# Altium schematic sheet NIXIEClock.SchDoc
size A1; SheetNumber: 1; SheetTotal: 1
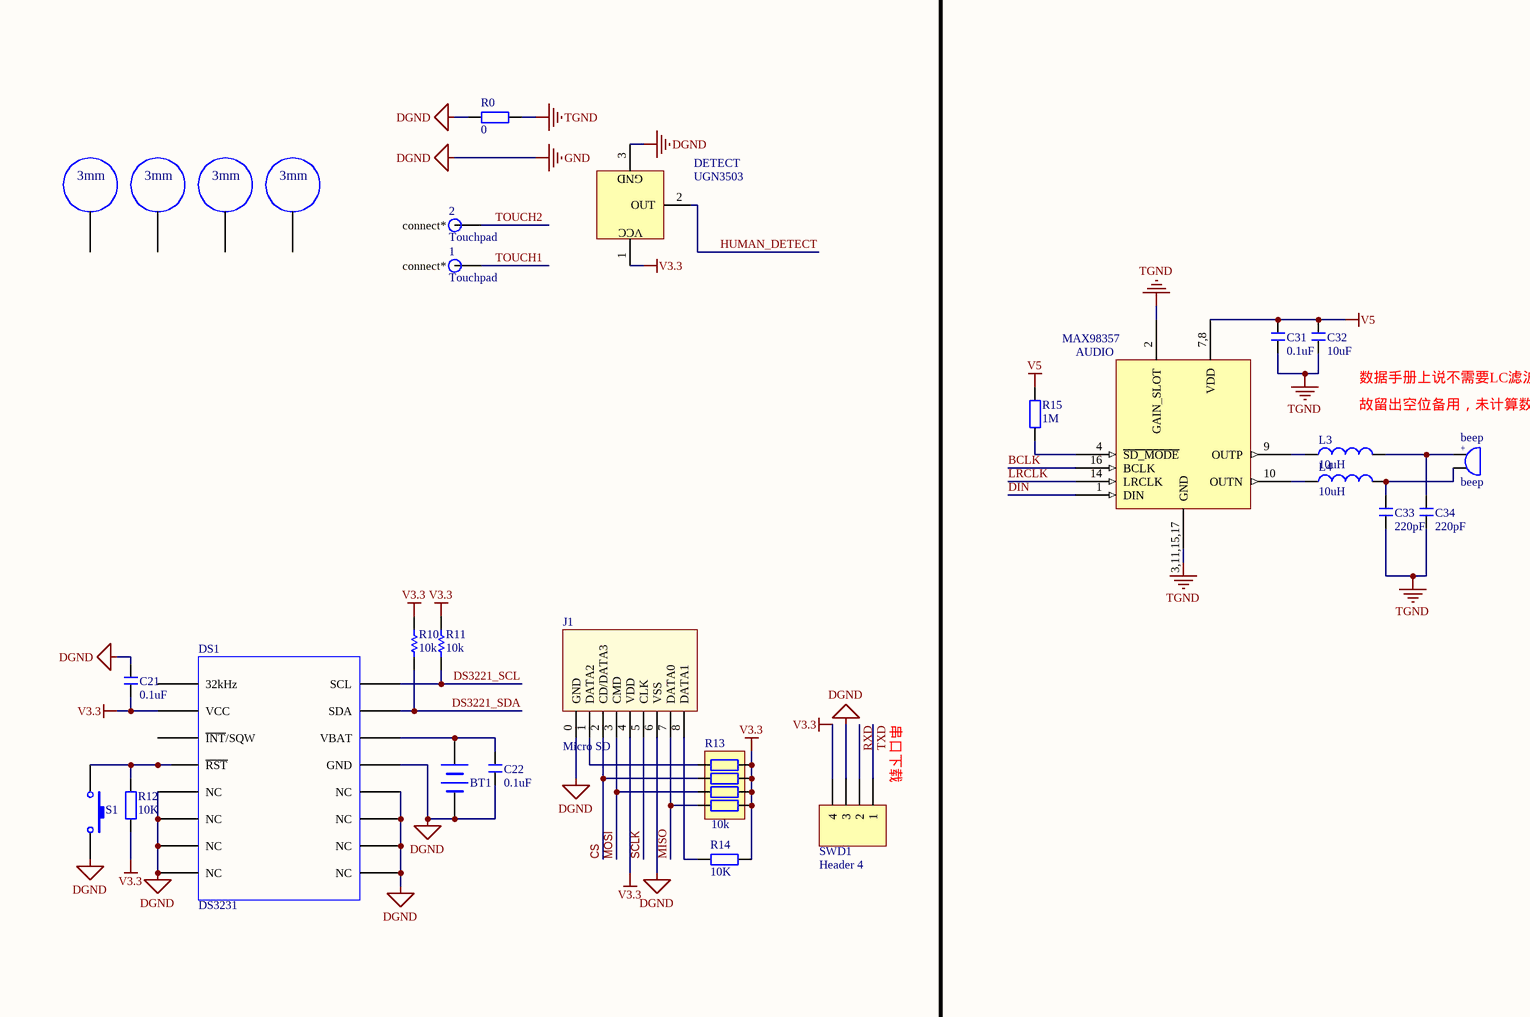
[diagram p0: NIXIEClock.SchDoc, top left]
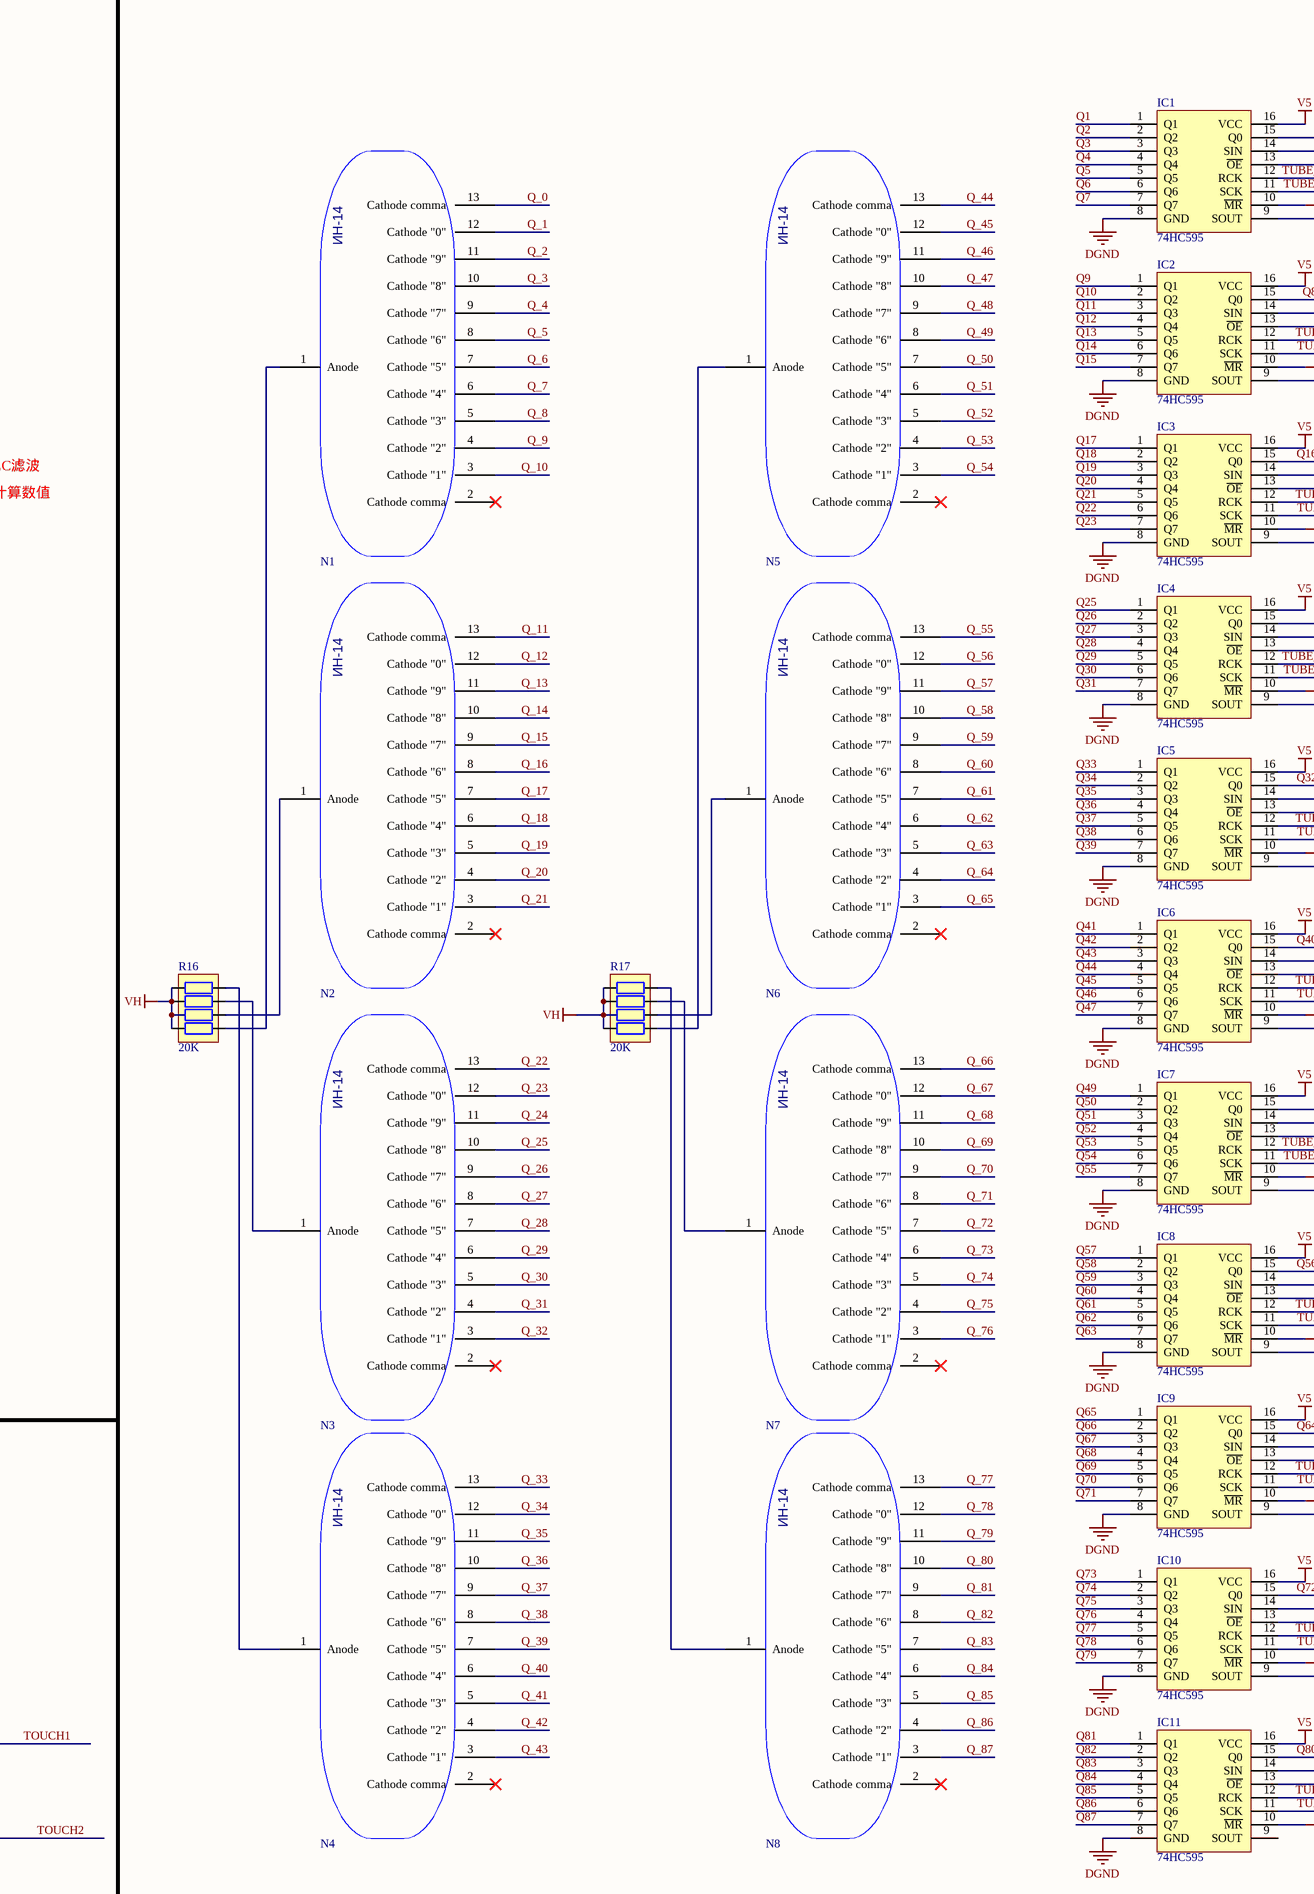
[diagram p1: NIXIEClock.SchDoc, top middle]
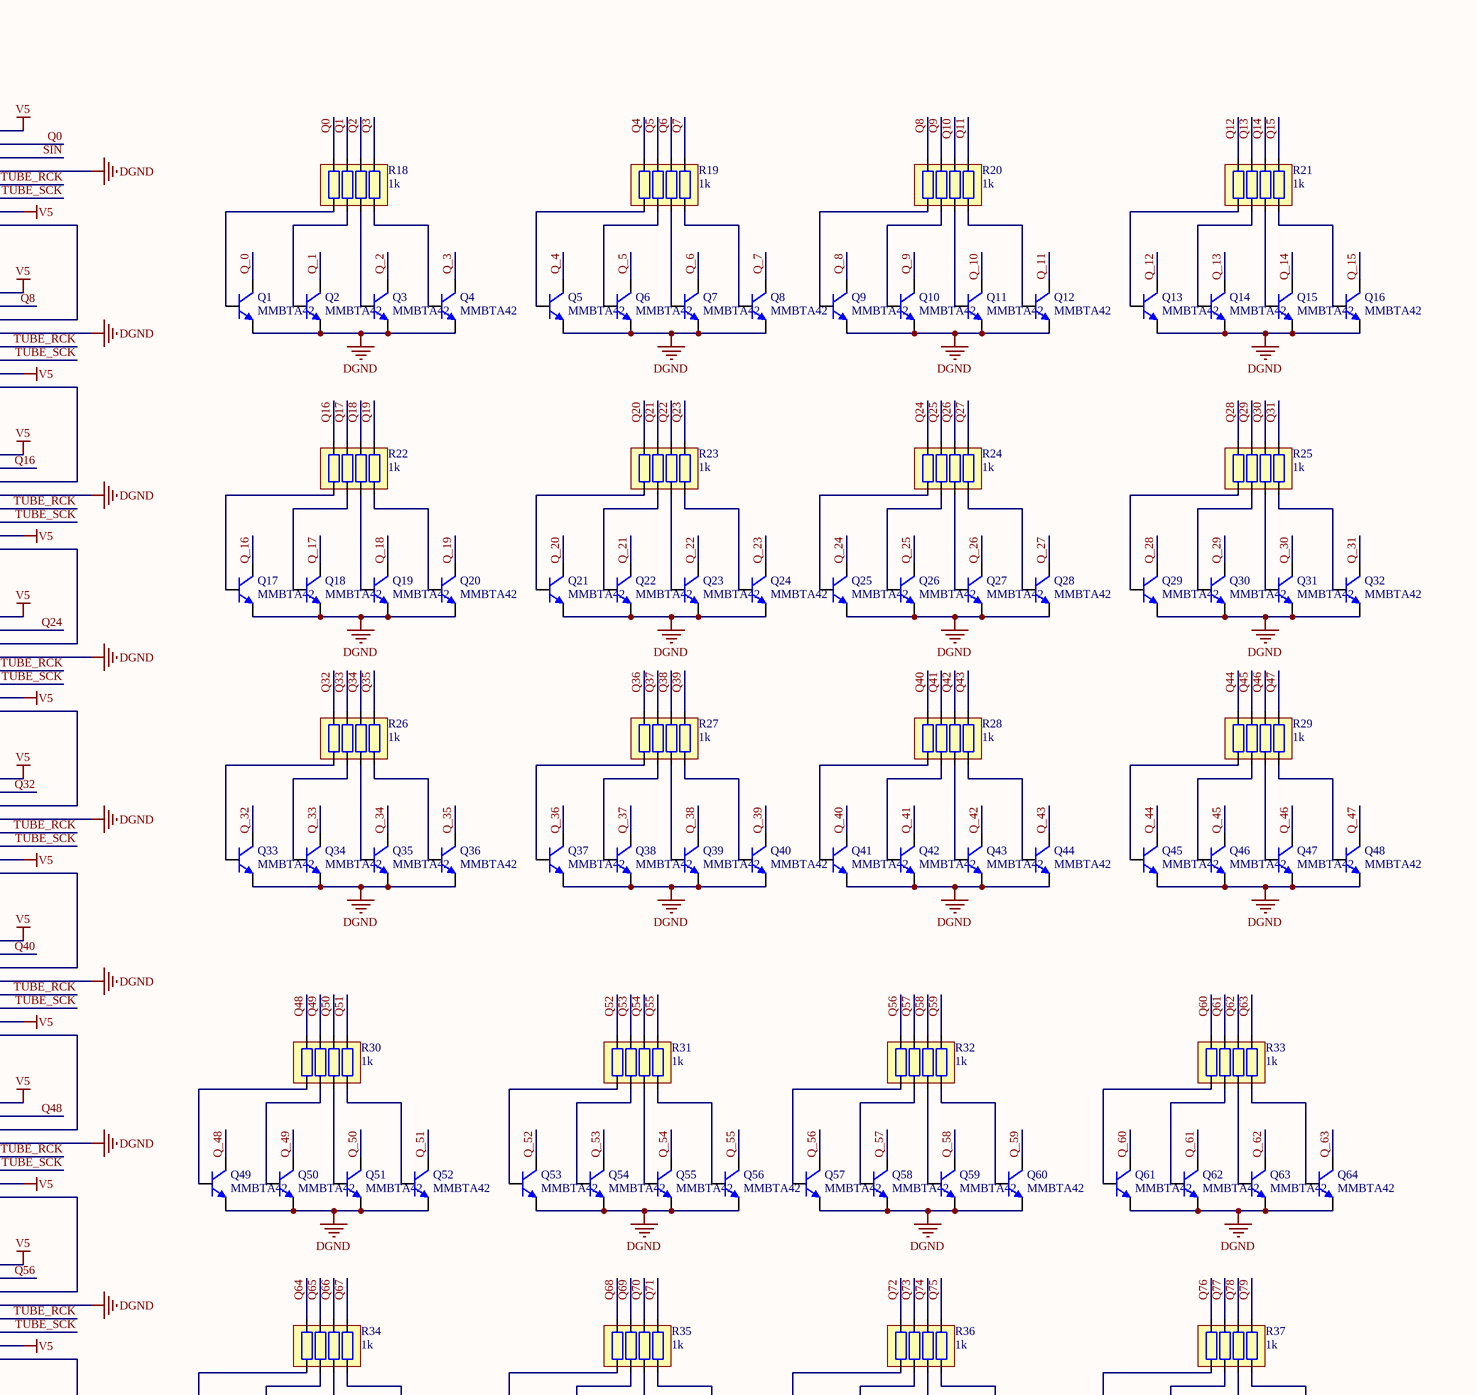
[diagram p2: NIXIEClock.SchDoc, top right]
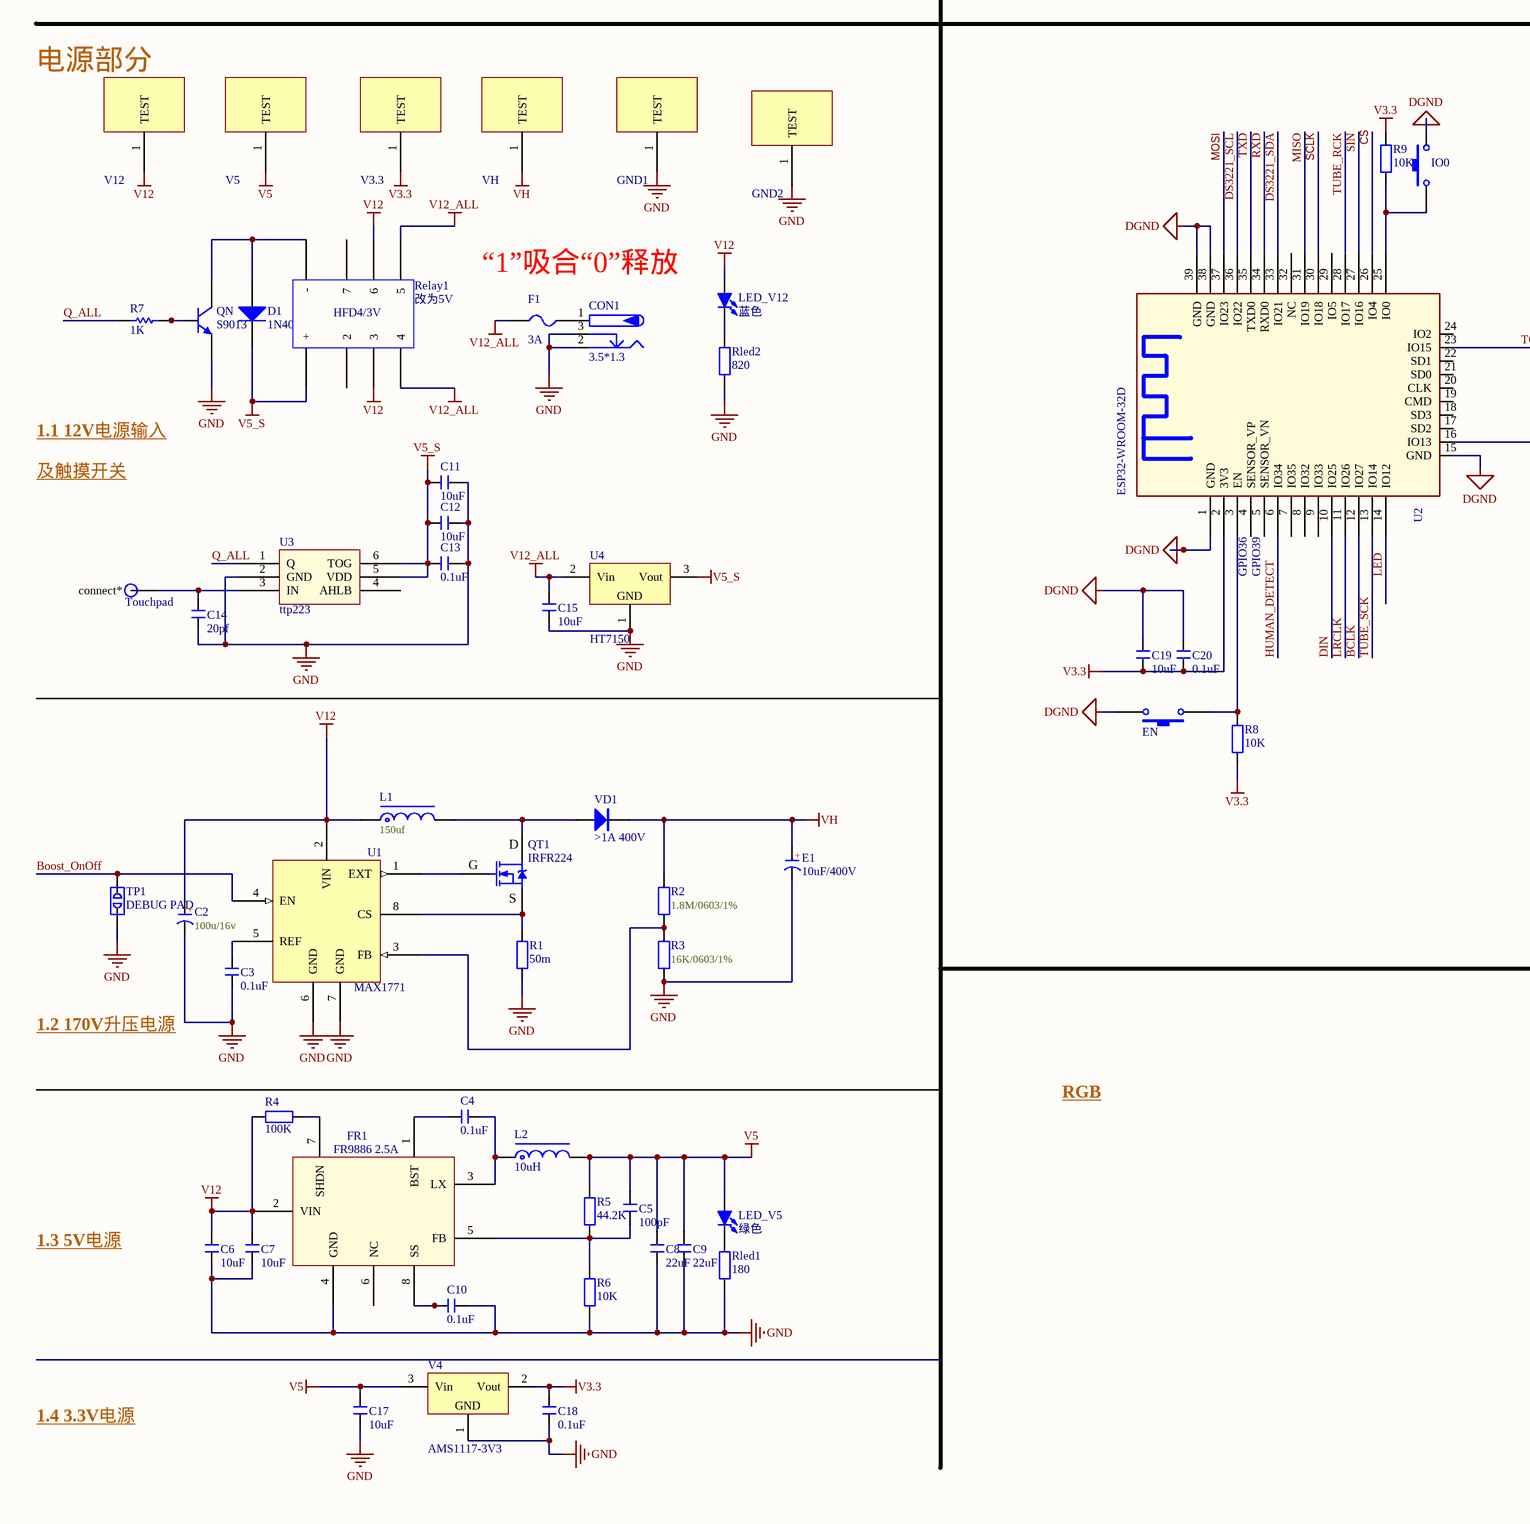
[diagram p3: NIXIEClock.SchDoc, bottom left]
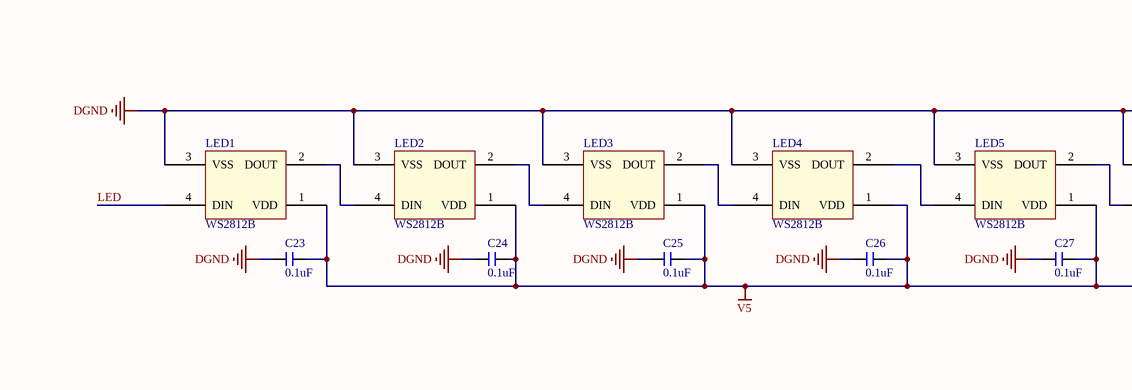
[diagram p4: NIXIEClock.SchDoc, bottom middle]
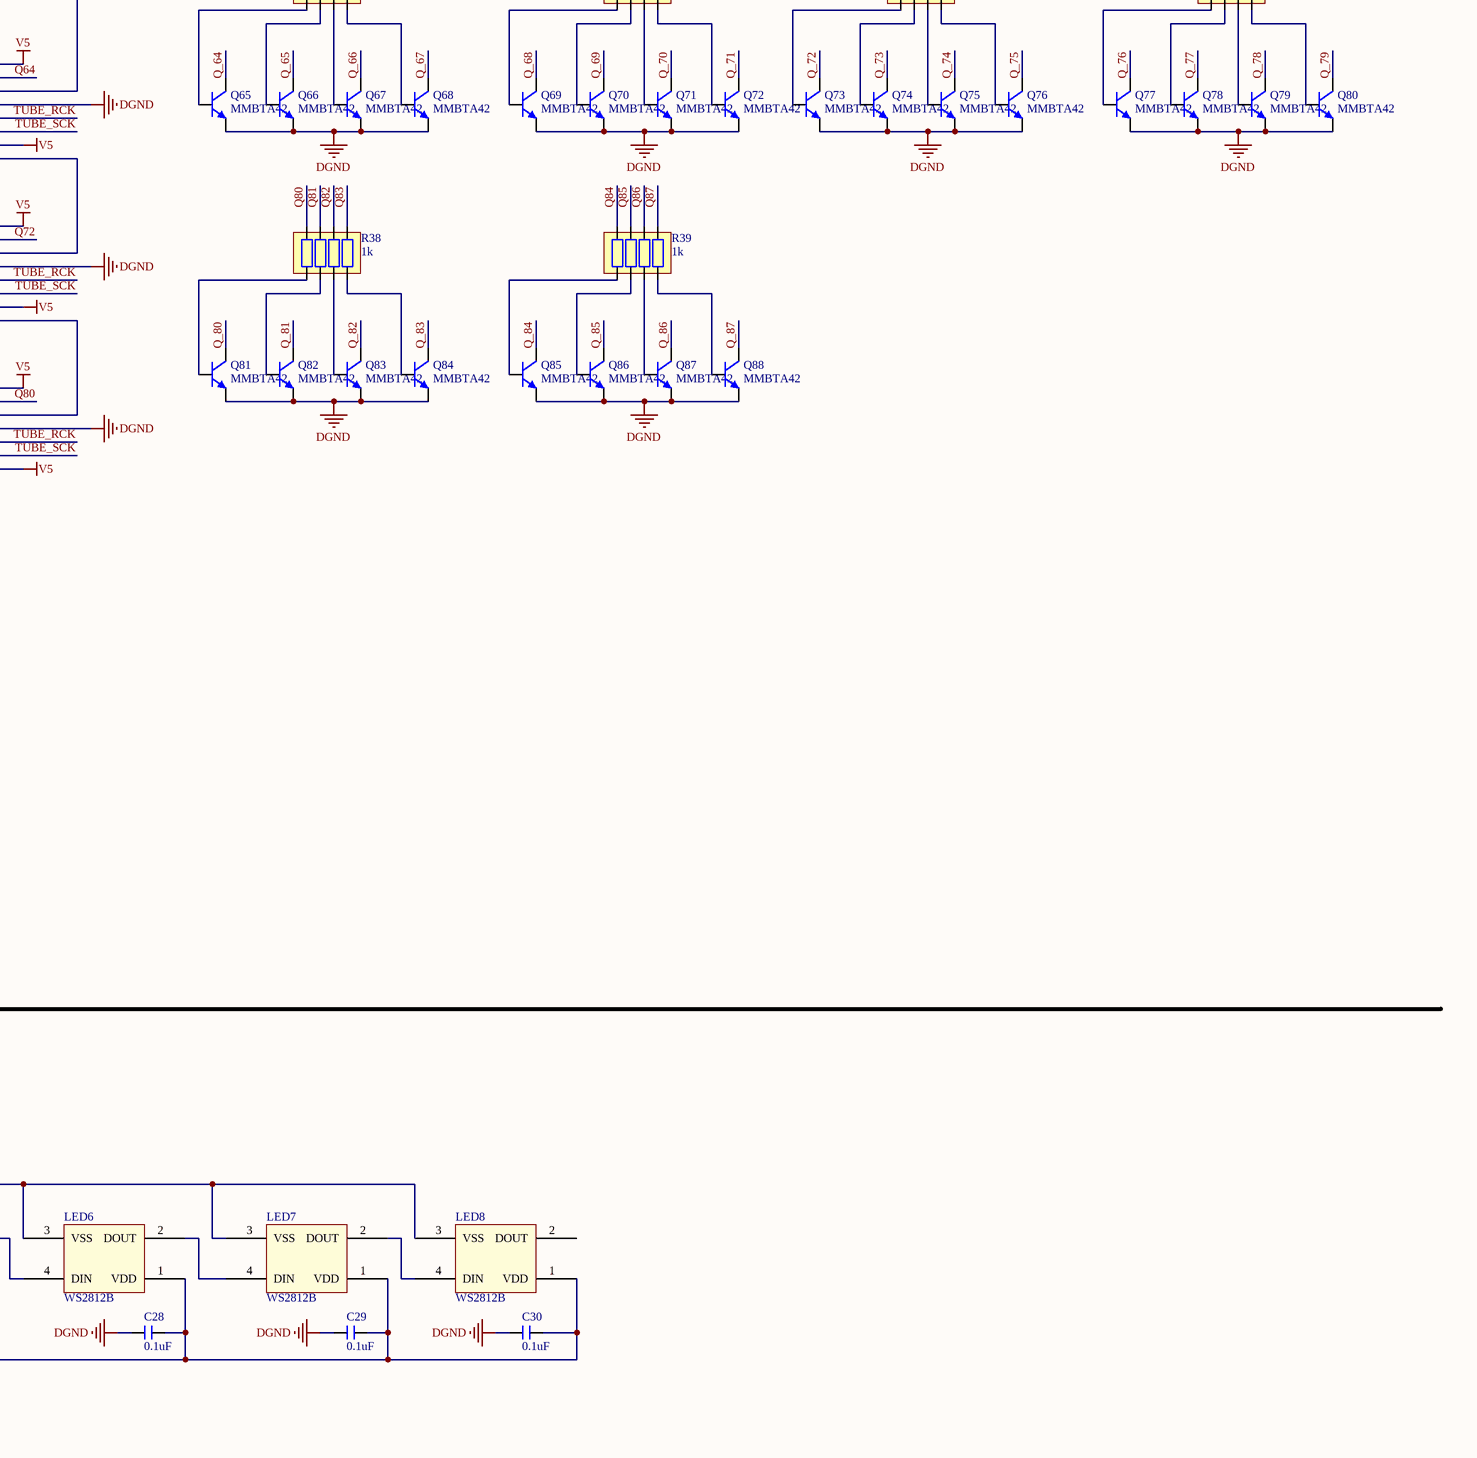
[diagram p5: NIXIEClock.SchDoc, bottom right]

## Parts
1  Touchpad  [TOUCHPAD]
2  Touchpad  [TOUCHPAD]
AUDIO  MAX98357  [QFN16_3X3]
beep  beep  [BEEP2]
BT1  CR1220 holder  [BAT1220]  (value not drawn)
C2  100u/16v  [CD C(6032)]
C3  0.1uF  [C 0603_L]
C4  0.1uF  [C 0603_L]
C5  100pF  [C 0603_L]
C6  10uF  [C 0805_L]
C7  10uF  [C 0805_L]
C8  22uF  [C 0805_L]
C9  22uF  [C 0805_L]
C10  0.1uF  [C 0603_L]
C11  10uF  [C 0805_L]
C12  10uF  [C 0805_L]
C13  0.1uF  [C 0603_L]
C14  20pf  [C 0603]
C15  10uF  [C 0805_L]
C17  10uF  [C 0805_L]
C18  0.1uF  [C 0603_L]
C19  10uF  [C 0805_L]
C20  0.1uF  [C 0603_L]
C21  0.1uF  [C 0603_L]
C22  0.1uF  [C 0603_L]
C23  0.1uF  [C 0603_L]
C24  0.1uF  [C 0603_L]
C25  0.1uF  [C 0603_L]
C26  0.1uF  [C 0603_L]
C27  0.1uF  [C 0603_L]
C28  0.1uF  [C 0603_L]
C29  0.1uF  [C 0603_L]
C30  0.1uF  [C 0603_L]
C31  0.1uF  [C 0603_L]
C32  10uF  [C 0805_L]
C33  220pF  [C 0805_L]
C34  220pF  [C 0805_L]
CON1  3.5*1.3  [DC-050]
D1  1N4007  [1N4007W]
DETECT  UGN3503  [红外热释电]
DS1  DS3231  [SOP16_75MM]
E1  10uF/400V  [CM F(10*10.2)]
EN  SW-PB  [贴片按键（红头）]  (value not drawn)
F1  3A  [FU 1206]
FR1  FR9886 2.5A  [SOP8_N]
GND1  TEST  [TEST]  (value not drawn)
GND2  TEST  [TEST]  (value not drawn)
IC1  74HC595  [TSSOP16_N]
IC2  74HC595  [TSSOP16_N]
IC3  74HC595  [TSSOP16_N]
IC4  74HC595  [TSSOP16_N]
IC5  74HC595  [TSSOP16_N]
IC6  74HC595  [TSSOP16_N]
IC7  74HC595  [TSSOP16_N]
IC8  74HC595  [TSSOP16_N]
IC9  74HC595  [TSSOP16_N]
IC10  74HC595  [TSSOP16_N]
IC11  74HC595  [TSSOP16_N]
IO0  SW-PB  [贴片按键（红头）]  (value not drawn)
J1  Micro SD  [Micro SD]
L1  150uf  [CDRH127]
L2  10uH  [L-SMD-0630]
L3  10uH  [L 0805_L]
L4  10uH  [L 0805_L]
LED1  WS2812B  [WS2812B-5050]
LED2  WS2812B  [WS2812B-5050]
LED3  WS2812B  [WS2812B-5050]
LED4  WS2812B  [WS2812B-5050]
LED5  WS2812B  [WS2812B-5050]
LED6  WS2812B  [WS2812B-5050]
LED7  WS2812B  [WS2812B-5050]
LED8  WS2812B  [WS2812B-5050]
LED_V5  绿色  [LED 0805G]
LED_V12  蓝色  [LED 0805B]
N1  ИН-14  [IN14]  (value not drawn)
N2  ИН-14  [IN14]  (value not drawn)
N3  ИН-14  [IN14]  (value not drawn)
N4  ИН-14  [IN14]  (value not drawn)
N5  ИН-14  [IN14]  (value not drawn)
N6  ИН-14  [IN14]  (value not drawn)
N7  ИН-14  [IN14]  (value not drawn)
N8  ИН-14  [IN14]  (value not drawn)
Q1  MMBTA42  [SOT23-3N]
Q2  MMBTA42  [SOT23-3N]
Q3  MMBTA42  [SOT23-3N]
Q4  MMBTA42  [SOT23-3N]
Q5  MMBTA42  [SOT23-3N]
Q6  MMBTA42  [SOT23-3N]
Q7  MMBTA42  [SOT23-3N]
Q8  MMBTA42  [SOT23-3N]
Q9  MMBTA42  [SOT23-3N]
Q10  MMBTA42  [SOT23-3N]
Q11  MMBTA42  [SOT23-3N]
Q12  MMBTA42  [SOT23-3N]
Q13  MMBTA42  [SOT23-3N]
Q14  MMBTA42  [SOT23-3N]
Q15  MMBTA42  [SOT23-3N]
Q16  MMBTA42  [SOT23-3N]
Q17  MMBTA42  [SOT23-3N]
Q18  MMBTA42  [SOT23-3N]
Q19  MMBTA42  [SOT23-3N]
Q20  MMBTA42  [SOT23-3N]
Q21  MMBTA42  [SOT23-3N]
Q22  MMBTA42  [SOT23-3N]
Q23  MMBTA42  [SOT23-3N]
Q24  MMBTA42  [SOT23-3N]
Q25  MMBTA42  [SOT23-3N]
Q26  MMBTA42  [SOT23-3N]
Q27  MMBTA42  [SOT23-3N]
Q28  MMBTA42  [SOT23-3N]
Q29  MMBTA42  [SOT23-3N]
Q30  MMBTA42  [SOT23-3N]
Q31  MMBTA42  [SOT23-3N]
Q32  MMBTA42  [SOT23-3N]
Q33  MMBTA42  [SOT23-3N]
Q34  MMBTA42  [SOT23-3N]
Q35  MMBTA42  [SOT23-3N]
Q36  MMBTA42  [SOT23-3N]
Q37  MMBTA42  [SOT23-3N]
Q38  MMBTA42  [SOT23-3N]
Q39  MMBTA42  [SOT23-3N]
Q40  MMBTA42  [SOT23-3N]
Q41  MMBTA42  [SOT23-3N]
Q42  MMBTA42  [SOT23-3N]
Q43  MMBTA42  [SOT23-3N]
Q44  MMBTA42  [SOT23-3N]
Q45  MMBTA42  [SOT23-3N]
Q46  MMBTA42  [SOT23-3N]
Q47  MMBTA42  [SOT23-3N]
Q48  MMBTA42  [SOT23-3N]
Q49  MMBTA42  [SOT23-3N]
Q50  MMBTA42  [SOT23-3N]
Q51  MMBTA42  [SOT23-3N]
Q52  MMBTA42  [SOT23-3N]
Q53  MMBTA42  [SOT23-3N]
Q54  MMBTA42  [SOT23-3N]
Q55  MMBTA42  [SOT23-3N]
Q56  MMBTA42  [SOT23-3N]
Q57  MMBTA42  [SOT23-3N]
Q58  MMBTA42  [SOT23-3N]
Q59  MMBTA42  [SOT23-3N]
Q60  MMBTA42  [SOT23-3N]
Q61  MMBTA42  [SOT23-3N]
Q62  MMBTA42  [SOT23-3N]
Q63  MMBTA42  [SOT23-3N]
Q64  MMBTA42  [SOT23-3N]
Q65  MMBTA42  [SOT23-3N]
Q66  MMBTA42  [SOT23-3N]
Q67  MMBTA42  [SOT23-3N]
Q68  MMBTA42  [SOT23-3N]
Q69  MMBTA42  [SOT23-3N]
Q70  MMBTA42  [SOT23-3N]
Q71  MMBTA42  [SOT23-3N]
Q72  MMBTA42  [SOT23-3N]
Q73  MMBTA42  [SOT23-3N]
Q74  MMBTA42  [SOT23-3N]
Q75  MMBTA42  [SOT23-3N]
Q76  MMBTA42  [SOT23-3N]
Q77  MMBTA42  [SOT23-3N]
Q78  MMBTA42  [SOT23-3N]
Q79  MMBTA42  [SOT23-3N]
Q80  MMBTA42  [SOT23-3N]
Q81  MMBTA42  [SOT23-3N]
Q82  MMBTA42  [SOT23-3N]
Q83  MMBTA42  [SOT23-3N]
Q84  MMBTA42  [SOT23-3N]
Q85  MMBTA42  [SOT23-3N]
Q86  MMBTA42  [SOT23-3N]
Q87  MMBTA42  [SOT23-3N]
Q88  MMBTA42  [SOT23-3N]
QN  S9013  [SOT23-3L]
QT1  IRFR224  [TO252]
R0  0  [R 0603]
R1  50m  [R 0805_L]
R2  1.8M/0603/1%  [R 0603]
R3  16K/0603/1%  [R 0603]
R4  100K  [R 0603_L]
R5  44.2K  [R 0603]
R6  10K  [R 0603]
R7  value 1K  [R 0603]  (hidden comment: Res Semi)
R8  10K  [R 0603]
R9  10K  [R 0603]
R10  value 10k  [R 0603]  (hidden comment: Res Semi)
R11  value 10k  [R 0603]  (hidden comment: Res Semi)
R12  10K  [R 0603]
R13  10k  [RCA-8P4R-0603]
R14  10K  [R 0603]
R15  1M  [R 0603]
R16  20K  [RCA-8P4R-0603]
R17  20K  [RCA-8P4R-0603]
R18  1k  [RCA-8P4R-0603]
R19  1k  [RCA-8P4R-0603]
R20  1k  [RCA-8P4R-0603]
R21  1k  [RCA-8P4R-0603]
R22  1k  [RCA-8P4R-0603]
R23  1k  [RCA-8P4R-0603]
R24  1k  [RCA-8P4R-0603]
R25  1k  [RCA-8P4R-0603]
R26  1k  [RCA-8P4R-0603]
R27  1k  [RCA-8P4R-0603]
R28  1k  [RCA-8P4R-0603]
R29  1k  [RCA-8P4R-0603]
R30  1k  [RCA-8P4R-0603]
R31  1k  [RCA-8P4R-0603]
R32  1k  [RCA-8P4R-0603]
R33  1k  [RCA-8P4R-0603]
R34  1k  [RCA-8P4R-0603]
R35  1k  [RCA-8P4R-0603]
R36  1k  [RCA-8P4R-0603]
R37  1k  [RCA-8P4R-0603]
R38  1k  [RCA-8P4R-0603]
R39  1k  [RCA-8P4R-0603]
Relay1  改为5V  [HFD4]
Rled1  180  [R 0603]
Rled2  820  [R 0603]
S1  SW-PB  [贴片按键（红头）]  (value not drawn)
SWD1  Header 4  [HDR2.54-M-WS-4P]
T0  铜柱  [铜柱_六芒星]  (value not drawn)
T1  铜柱  [铜柱_六芒星]  (value not drawn)
T2  铜柱  [铜柱_六芒星]  (value not drawn)
T3  铜柱  [铜柱_六芒星]  (value not drawn)
TOUCH  Touchpad  [TOUCHPAD]
TP1  DEBUG PAD  [DEBUG PAD2]
U1  MAX1771  [SOP8_M]
U2  ESP32-WROOM-32D  [*MODULE_ESP32-WROOM-32D]
U3  ttp223  [SOT23-6L]
U4  HT7150  [SOT89_M]
V3.3  TEST  [TEST]  (value not drawn)
V4  AMS1117-3V3  [SOT223_N]
V5  TEST  [TEST]  (value not drawn)
V12  TEST  [TEST]  (value not drawn)
VD1  >1A 400V  [SMA]
VH  TEST  [TEST]  (value not drawn)

## Nets
DGND: BT1.2(-) C2.2(K) C3.2 C6.1 C7.1 C8.1 C9.1 C10.1 C11.1 C12.1 C13.2 C14.1 C15.2 C17.1 C18.1 C19.2 C20.2 C21.2 C22.2 C23.1 C24.1 C25.1 C26.1 C27.1 C28.1 C29.1 C30.1 CON1.2 CON1.3 DETECT.3(GND) DS1.5(NC) DS1.6(NC) DS1.7(NC) DS1.8(NC) DS1.9(NC) DS1.10(NC) DS1.11(NC) DS1.12(NC) DS1.13(GND) E1.2(K) EN.2 FR1.4(GND) GND1.1(TEST) GND2.1(TEST) IC1.8(GND) IC1.13(~{OE}) IC2.8(GND) IC2.13(~{OE}) IC3.8(GND) IC3.13(~{OE}) IC4.8(GND) IC4.13(~{OE}) IC5.8(GND) IC5.13(~{OE}) IC6.8(GND) IC6.13(~{OE}) IC7.8(GND) IC7.13(~{OE}) IC8.8(GND) IC8.13(~{OE}) IC9.8(GND) IC9.13(~{OE}) IC10.8(GND) IC10.13(~{OE}) IC11.8(GND) IC11.13(~{OE}) IO0.2 J1.0(GND) J1.6(VSS) LED1.3(VSS) LED2.3(VSS) LED3.3(VSS) LED4.3(VSS) LED5.3(VSS) LED6.3(VSS) LED7.3(VSS) LED8.3(VSS) Q1.2(E) Q2.2(E) Q3.2(E) Q4.2(E) Q5.2(E) Q6.2(E) Q7.2(E) Q8.2(E) Q9.2(E) Q10.2(E) Q11.2(E) Q12.2(E) Q13.2(E) Q14.2(E) Q15.2(E) Q16.2(E) Q17.2(E) Q18.2(E) Q19.2(E) Q20.2(E) Q21.2(E) Q22.2(E) Q23.2(E) Q24.2(E) Q25.2(E) Q26.2(E) Q27.2(E) Q28.2(E) Q29.2(E) Q30.2(E) Q31.2(E) Q32.2(E) Q33.2(E) Q34.2(E) Q35.2(E) Q36.2(E) Q37.2(E) Q38.2(E) Q39.2(E) Q40.2(E) Q41.2(E) Q42.2(E) Q43.2(E) Q44.2(E) Q45.2(E) Q46.2(E) Q47.2(E) Q48.2(E) Q49.2(E) Q50.2(E) Q51.2(E) Q52.2(E) Q53.2(E) Q54.2(E) Q55.2(E) Q56.2(E) Q57.2(E) Q58.2(E) Q59.2(E) Q60.2(E) Q61.2(E) Q62.2(E) Q63.2(E) Q64.2(E) Q65.2(E) Q66.2(E) Q67.2(E) Q68.2(E) Q69.2(E) Q70.2(E) Q71.2(E) Q72.2(E) Q73.2(E) Q74.2(E) Q75.2(E) Q76.2(E) Q77.2(E) Q78.2(E) Q79.2(E) Q80.2(E) Q81.2(E) Q82.2(E) Q83.2(E) Q84.2(E) Q85.2(E) Q86.2(E) Q87.2(E) Q88.2(E) QN.2(E) R0.1 R1.1 R3.1 R6.1 Rled1.1 Rled2.1 S1.2 SWD1.3 TP1.1 U1.6(GND) U1.7(GND) U2.1(GND) U2.15(GND) U2.38(GND) U2.39(GND) U3.2(GND) U4.1(GND) V4.1(GND)  [also labelled GND]
TGND: AUDIO.2(GAIN_SLOT) AUDIO.3,11,15,17(GND) C31.2 C32.2 C33.2 C34.2 R0.2
V3.3: C18.2 C19.1 C20.1 C21.1 DETECT.1(VCC) DS1.2(VCC) J1.4(VDD) R8.2 R9.2 R10.2 R11.2 R12.2 R13.1 R13.2 R13.3 R13.4 R14.2 SWD1.4 U2.2(3V3) V3.3.1(TEST) V4.2(Vout)
V5: AUDIO.7,8(VDD) C5.2 C8.2 C9.2 C17.2 C23.2 C24.2 C25.2 C26.2 C27.2 C28.2 C29.2 C30.2 C31.1 C32.1 IC1.10(~{MR}) IC1.16(VCC) IC2.10(~{MR}) IC2.16(VCC) IC3.10(~{MR}) IC3.16(VCC) IC4.10(~{MR}) IC4.16(VCC) IC5.10(~{MR}) IC5.16(VCC) IC6.10(~{MR}) IC6.16(VCC) IC7.10(~{MR}) IC7.16(VCC) IC8.10(~{MR}) IC8.16(VCC) IC9.10(~{MR}) IC9.16(VCC) IC10.10(~{MR}) IC10.16(VCC) IC11.10(~{MR}) IC11.16(VCC) L2.2 LED1.1(VDD) LED2.1(VDD) LED3.1(VDD) LED4.1(VDD) LED5.1(VDD) LED6.1(VDD) LED7.1(VDD) LED8.1(VDD) LED_V5.1(A) R5.2 R15.1 V4.3(Vin) V5.1(TEST)
V5_S: C11.2 C12.2 C13.1 D1.2(K) Relay1.1(+) U3.5(VDD) U3.6(TOG) U4.3(Vout)
V12: C2.1(A) C6.2 C7.2 FR1.2(VIN) L1.1 LED_V12.1(A) R4.1 Relay1.3 Relay1.6 U1.2(VIN) V12.1(TEST)
V12_ALL: C15.1 F1.2 Relay1.4 Relay1.5 U4.2(Vin)
VH: E1.1(A) R2.2 R16.1 R16.2 R16.3 R16.4 R17.1 R17.2 R17.3 R17.4 VD1.2(K) VH.1(TEST)
BCLK: AUDIO.16(BCLK) U2.12(IO27)
Boost_OnOff: TP1.2 U1.4(EN)
CS: J1.2(CD/DATA3) R13.6 U2.26(IO4)
DIN: AUDIO.1(DIN) U2.10(IO25)
DS3221_SCL: DS1.16(SCL) R11.1 U2.36(IO22)
DS3221_SDA: DS1.15(SDA) R10.1 U2.33(IO21)
HUMAN_DETECT: DETECT.2(OUT) U2.6(IO34)
LED: LED1.4(DIN) U2.14(IO12)
LRCLK: AUDIO.14(LRCLK) U2.11(IO26)
MISO: J1.7(DATA0) R13.8 U2.31(IO19)
MOSI: J1.3(CMD) R13.7 U2.37(IO23)
Q0: IC1.15(Q0) R18.8
Q1: IC1.1(Q1) R18.7
Q2: IC1.2(Q2) R18.6
Q3: IC1.3(Q3) R18.5
Q4: IC1.4(Q4) R19.8
Q5: IC1.5(Q5) R19.7
Q6: IC1.6(Q6) R19.6
Q7: IC1.7(Q7) R19.5
Q8: IC2.15(Q0) R20.8
Q9: IC2.1(Q1) R20.7
Q10: IC2.2(Q2) R20.6
Q11: IC2.3(Q3) R20.5
Q12: IC2.4(Q4) R21.8
Q13: IC2.5(Q5) R21.7
Q14: IC2.6(Q6) R21.6
Q15: IC2.7(Q7) R21.5
Q16: IC3.15(Q0) R22.8
Q17: IC3.1(Q1) R22.7
Q18: IC3.2(Q2) R22.6
Q19: IC3.3(Q3) R22.5
Q20: IC3.4(Q4) R23.8
Q21: IC3.5(Q5) R23.7
Q22: IC3.6(Q6) R23.6
Q23: IC3.7(Q7) R23.5
Q24: IC4.15(Q0) R24.8
Q25: IC4.1(Q1) R24.7
Q26: IC4.2(Q2) R24.6
Q27: IC4.3(Q3) R24.5
Q28: IC4.4(Q4) R25.8
Q29: IC4.5(Q5) R25.7
Q30: IC4.6(Q6) R25.6
Q31: IC4.7(Q7) R25.5
Q32: IC5.15(Q0) R26.8
Q33: IC5.1(Q1) R26.7
Q34: IC5.2(Q2) R26.6
Q35: IC5.3(Q3) R26.5
Q36: IC5.4(Q4) R27.8
Q37: IC5.5(Q5) R27.7
Q38: IC5.6(Q6) R27.6
Q39: IC5.7(Q7) R27.5
Q40: IC6.15(Q0) R28.8
Q41: IC6.1(Q1) R28.7
Q42: IC6.2(Q2) R28.6
Q43: IC6.3(Q3) R28.5
Q44: IC6.4(Q4) R29.8
Q45: IC6.5(Q5) R29.7
Q46: IC6.6(Q6) R29.6
Q47: IC6.7(Q7) R29.5
Q48: IC7.15(Q0) R30.8
Q49: IC7.1(Q1) R30.7
Q50: IC7.2(Q2) R30.6
Q51: IC7.3(Q3) R30.5
Q52: IC7.4(Q4) R31.8
Q53: IC7.5(Q5) R31.7
Q54: IC7.6(Q6) R31.6
Q55: IC7.7(Q7) R31.5
Q56: IC8.15(Q0) R32.8
Q57: IC8.1(Q1) R32.7
Q58: IC8.2(Q2) R32.6
Q59: IC8.3(Q3) R32.5
Q60: IC8.4(Q4) R33.8
Q61: IC8.5(Q5) R33.7
Q62: IC8.6(Q6) R33.6
Q63: IC8.7(Q7) R33.5
Q64: IC9.15(Q0) R34.8
Q65: IC9.1(Q1) R34.7
Q66: IC9.2(Q2) R34.6
Q67: IC9.3(Q3) R34.5
Q68: IC9.4(Q4) R35.8
Q69: IC9.5(Q5) R35.7
Q70: IC9.6(Q6) R35.6
Q71: IC9.7(Q7) R35.5
Q72: IC10.15(Q0) R36.8
Q73: IC10.1(Q1) R36.7
Q74: IC10.2(Q2) R36.6
Q75: IC10.3(Q3) R36.5
Q76: IC10.4(Q4) R37.8
Q77: IC10.5(Q5) R37.7
Q78: IC10.6(Q6) R37.6
Q79: IC10.7(Q7) R37.5
Q80: IC11.15(Q0) R38.8
Q81: IC11.1(Q1) R38.7
Q82: IC11.2(Q2) R38.6
Q83: IC11.3(Q3) R38.5
Q84: IC11.4(Q4) R39.8
Q85: IC11.5(Q5) R39.7
Q86: IC11.6(Q6) R39.6
Q87: IC11.7(Q7) R39.5
Q_0: N1.13(Cathode_comma) Q1.3(C)
Q_1: N1.12(Cathode_"0") Q2.3(C)
Q_2: N1.11(Cathode_"9") Q3.3(C)
Q_3: N1.10(Cathode_"8") Q4.3(C)
Q_4: N1.9(Cathode_"7") Q5.3(C)
Q_5: N1.8(Cathode_"6") Q6.3(C)
Q_6: N1.7(Cathode_"5") Q7.3(C)
Q_7: N1.6(Cathode_"4") Q8.3(C)
Q_8: N1.5(Cathode_"3") Q9.3(C)
Q_9: N1.4(Cathode_"2") Q10.3(C)
Q_10: N1.3(Cathode_"1") Q11.3(C)
Q_11: N2.13(Cathode_comma) Q12.3(C)
Q_12: N2.12(Cathode_"0") Q13.3(C)
Q_13: N2.11(Cathode_"9") Q14.3(C)
Q_14: N2.10(Cathode_"8") Q15.3(C)
Q_15: N2.9(Cathode_"7") Q16.3(C)
Q_16: N2.8(Cathode_"6") Q17.3(C)
Q_17: N2.7(Cathode_"5") Q18.3(C)
Q_18: N2.6(Cathode_"4") Q19.3(C)
Q_19: N2.5(Cathode_"3") Q20.3(C)
Q_20: N2.4(Cathode_"2") Q21.3(C)
Q_21: N2.3(Cathode_"1") Q22.3(C)
Q_22: N3.13(Cathode_comma) Q23.3(C)
Q_23: N3.12(Cathode_"0") Q24.3(C)
Q_24: N3.11(Cathode_"9") Q25.3(C)
Q_25: N3.10(Cathode_"8") Q26.3(C)
Q_26: N3.9(Cathode_"7") Q27.3(C)
Q_27: N3.8(Cathode_"6") Q28.3(C)
Q_28: N3.7(Cathode_"5") Q29.3(C)
Q_29: N3.6(Cathode_"4") Q30.3(C)
Q_30: N3.5(Cathode_"3") Q31.3(C)
Q_31: N3.4(Cathode_"2") Q32.3(C)
Q_32: N3.3(Cathode_"1") Q33.3(C)
Q_33: N4.13(Cathode_comma) Q34.3(C)
Q_34: N4.12(Cathode_"0") Q35.3(C)
Q_35: N4.11(Cathode_"9") Q36.3(C)
Q_36: N4.10(Cathode_"8") Q37.3(C)
Q_37: N4.9(Cathode_"7") Q38.3(C)
Q_38: N4.8(Cathode_"6") Q39.3(C)
Q_39: N4.7(Cathode_"5") Q40.3(C)
Q_40: N4.6(Cathode_"4") Q41.3(C)
Q_41: N4.5(Cathode_"3") Q42.3(C)
Q_42: N4.4(Cathode_"2") Q43.3(C)
Q_43: N4.3(Cathode_"1") Q44.3(C)
Q_44: N5.13(Cathode_comma) Q45.3(C)
Q_45: N5.12(Cathode_"0") Q46.3(C)
Q_46: N5.11(Cathode_"9") Q47.3(C)
Q_47: N5.10(Cathode_"8") Q48.3(C)
Q_48: N5.9(Cathode_"7") Q49.3(C)
Q_49: N5.8(Cathode_"6") Q50.3(C)
Q_50: N5.7(Cathode_"5") Q51.3(C)
Q_51: N5.6(Cathode_"4") Q52.3(C)
Q_52: N5.5(Cathode_"3") Q53.3(C)
Q_53: N5.4(Cathode_"2") Q54.3(C)
Q_54: N5.3(Cathode_"1") Q55.3(C)
Q_55: N6.13(Cathode_comma) Q56.3(C)
Q_56: N6.12(Cathode_"0") Q57.3(C)
Q_57: N6.11(Cathode_"9") Q58.3(C)
Q_58: N6.10(Cathode_"8") Q59.3(C)
Q_59: N6.9(Cathode_"7") Q60.3(C)
Q_60: N6.8(Cathode_"6") Q61.3(C)
Q_61: N6.7(Cathode_"5") Q62.3(C)
Q_62: N6.6(Cathode_"4") Q63.3(C)
Q_63: N6.5(Cathode_"3") Q64.3(C)
Q_64: N6.4(Cathode_"2") Q65.3(C)
Q_65: N6.3(Cathode_"1") Q66.3(C)
Q_66: N7.13(Cathode_comma) Q67.3(C)
Q_67: N7.12(Cathode_"0") Q68.3(C)
Q_68: N7.11(Cathode_"9") Q69.3(C)
Q_69: N7.10(Cathode_"8") Q70.3(C)
Q_70: N7.9(Cathode_"7") Q71.3(C)
Q_71: N7.8(Cathode_"6") Q72.3(C)
Q_72: N7.7(Cathode_"5") Q73.3(C)
Q_73: N7.6(Cathode_"4") Q74.3(C)
Q_74: N7.5(Cathode_"3") Q75.3(C)
Q_75: N7.4(Cathode_"2") Q76.3(C)
Q_76: N7.3(Cathode_"1") Q77.3(C)
Q_77: N8.13(Cathode_comma) Q78.3(C)
Q_78: N8.12(Cathode_"0") Q79.3(C)
Q_79: N8.11(Cathode_"9") Q80.3(C)
Q_80: N8.10(Cathode_"8") Q81.3(C)
Q_81: N8.9(Cathode_"7") Q82.3(C)
Q_82: N8.8(Cathode_"6") Q83.3(C)
Q_83: N8.7(Cathode_"5") Q84.3(C)
Q_84: N8.6(Cathode_"4") Q85.3(C)
Q_85: N8.5(Cathode_"3") Q86.3(C)
Q_86: N8.4(Cathode_"2") Q87.3(C)
Q_87: N8.3(Cathode_"1") Q88.3(C)
Q_ALL: R7.1 U3.1(Q)
RXD: SWD1.2 U2.34(RXD0)
SCLK: J1.5(CLK) U2.30(IO18)
SIN: IC1.14(SIN) U2.27(IO16)
TOUCH1: 1.P(connect*) U2.23(IO15)
TOUCH2: 2.P(connect*) U2.16(IO13)
TUBE_RCK: IC1.12(RCK) IC2.12(RCK) IC3.12(RCK) IC4.12(RCK) IC5.12(RCK) IC6.12(RCK) IC7.12(RCK) IC8.12(RCK) IC9.12(RCK) IC10.12(RCK) IC11.12(RCK) U2.28(IO17)
TUBE_SCK: IC1.11(SCK) IC2.11(SCK) IC3.11(SCK) IC4.11(SCK) IC5.11(SCK) IC6.11(SCK) IC7.11(SCK) IC8.11(SCK) IC9.11(SCK) IC10.11(SCK) IC11.11(SCK) U2.13(IO14)
TXD: SWD1.1 U2.35(TXD0)
NetAUDIO_4: AUDIO.4(~{SD_MODE}) R15.2
NetAUDIO_9: AUDIO.9(OUTP) L3.1
NetAUDIO_10: AUDIO.10(OUTN) L4.1
Netbeep_1: beep.1 C34.1 L3.2
Netbeep_2: beep.2 C33.1 L4.2
NetBT1_1: BT1.1(+) C22.1 DS1.14(VBAT)
NetC3_1: C3.1 U1.5(REF)
NetC4_1: C4.1 FR1.3(LX) L2.1
NetC4_2: C4.2 FR1.1(BST)
NetC5_1: C5.1 FR1.5(FB) R5.1 R6.2
NetC10_2: C10.2 FR1.8(SS)
NetC14_2: C14.2 TOUCH.P(connect*) U3.3(IN)
NetCON1_1: CON1.1 F1.1
NetD1_1: D1.1(A) QN.3(C) Relay1.8(-)
NetDS1_4: DS1.4(~{RST}) R12.1 S1.1
NetEN_1: EN.1 R8.1 U2.3(EN)
NetFR1_7: FR1.7(SHDN) R4.2
NetIC1_9: IC1.9(SOUT) IC2.14(SIN)
NetIC2_9: IC2.9(SOUT) IC3.14(SIN)
NetIC3_9: IC3.9(SOUT) IC4.14(SIN)
NetIC4_9: IC4.9(SOUT) IC5.14(SIN)
NetIC5_9: IC5.9(SOUT) IC6.14(SIN)
NetIC6_9: IC6.9(SOUT) IC7.14(SIN)
NetIC7_9: IC7.9(SOUT) IC8.14(SIN)
NetIC8_9: IC8.9(SOUT) IC9.14(SIN)
NetIC9_9: IC9.9(SOUT) IC10.14(SIN)
NetIC10_9: IC10.9(SOUT) IC11.14(SIN)
NetIO0_1: IO0.1 R9.1 U2.25(IO0)
NetJ1_1: J1.1(DATA2) R13.5
NetJ1_8: J1.8(DATA1) R14.1
NetL1_2: L1.2 QT1.2(D) VD1.1(A)
NetLED1_2: LED1.2(DOUT) LED2.4(DIN)
NetLED2_2: LED2.2(DOUT) LED3.4(DIN)
NetLED3_2: LED3.2(DOUT) LED4.4(DIN)
NetLED4_2: LED4.2(DOUT) LED5.4(DIN)
NetLED5_2: LED5.2(DOUT) LED6.4(DIN)
NetLED6_2: LED6.2(DOUT) LED7.4(DIN)
NetLED7_2: LED7.2(DOUT) LED8.4(DIN)
NetLED_V5_2: LED_V5.2(K) Rled1.2
NetLED_V12_2: LED_V12.2(K) Rled2.2
NetN1_1: N1.1(Anode) R16.5
NetN2_1: N2.1(Anode) R16.6
NetN3_1: N3.1(Anode) R16.7
NetN4_1: N4.1(Anode) R16.8
NetN5_1: N5.1(Anode) R17.5
NetN6_1: N6.1(Anode) R17.6
NetN7_1: N7.1(Anode) R17.7
NetN8_1: N8.1(Anode) R17.8
NetQ1_1: Q1.1(B) R18.1
NetQ2_1: Q2.1(B) R18.2
NetQ3_1: Q3.1(B) R18.3
NetQ4_1: Q4.1(B) R18.4
NetQ5_1: Q5.1(B) R19.1
NetQ6_1: Q6.1(B) R19.2
NetQ7_1: Q7.1(B) R19.3
NetQ8_1: Q8.1(B) R19.4
NetQ9_1: Q9.1(B) R20.1
NetQ10_1: Q10.1(B) R20.2
NetQ11_1: Q11.1(B) R20.3
NetQ12_1: Q12.1(B) R20.4
NetQ13_1: Q13.1(B) R21.1
NetQ14_1: Q14.1(B) R21.2
NetQ15_1: Q15.1(B) R21.3
NetQ16_1: Q16.1(B) R21.4
NetQ17_1: Q17.1(B) R22.1
NetQ18_1: Q18.1(B) R22.2
NetQ19_1: Q19.1(B) R22.3
NetQ20_1: Q20.1(B) R22.4
NetQ21_1: Q21.1(B) R23.1
NetQ22_1: Q22.1(B) R23.2
NetQ23_1: Q23.1(B) R23.3
NetQ24_1: Q24.1(B) R23.4
NetQ25_1: Q25.1(B) R24.1
NetQ26_1: Q26.1(B) R24.2
NetQ27_1: Q27.1(B) R24.3
NetQ28_1: Q28.1(B) R24.4
NetQ29_1: Q29.1(B) R25.1
NetQ30_1: Q30.1(B) R25.2
NetQ31_1: Q31.1(B) R25.3
NetQ32_1: Q32.1(B) R25.4
NetQ33_1: Q33.1(B) R26.1
NetQ34_1: Q34.1(B) R26.2
NetQ35_1: Q35.1(B) R26.3
NetQ36_1: Q36.1(B) R26.4
NetQ37_1: Q37.1(B) R27.1
NetQ38_1: Q38.1(B) R27.2
NetQ39_1: Q39.1(B) R27.3
NetQ40_1: Q40.1(B) R27.4
NetQ41_1: Q41.1(B) R28.1
NetQ42_1: Q42.1(B) R28.2
NetQ43_1: Q43.1(B) R28.3
NetQ44_1: Q44.1(B) R28.4
NetQ45_1: Q45.1(B) R29.1
NetQ46_1: Q46.1(B) R29.2
NetQ47_1: Q47.1(B) R29.3
NetQ48_1: Q48.1(B) R29.4
NetQ49_1: Q49.1(B) R30.1
NetQ50_1: Q50.1(B) R30.2
NetQ51_1: Q51.1(B) R30.3
NetQ52_1: Q52.1(B) R30.4
NetQ53_1: Q53.1(B) R31.1
NetQ54_1: Q54.1(B) R31.2
NetQ55_1: Q55.1(B) R31.3
NetQ56_1: Q56.1(B) R31.4
NetQ57_1: Q57.1(B) R32.1
NetQ58_1: Q58.1(B) R32.2
NetQ59_1: Q59.1(B) R32.3
NetQ60_1: Q60.1(B) R32.4
NetQ61_1: Q61.1(B) R33.1
NetQ62_1: Q62.1(B) R33.2
NetQ63_1: Q63.1(B) R33.3
NetQ64_1: Q64.1(B) R33.4
NetQ65_1: Q65.1(B) R34.1
NetQ66_1: Q66.1(B) R34.2
NetQ67_1: Q67.1(B) R34.3
NetQ68_1: Q68.1(B) R34.4
NetQ69_1: Q69.1(B) R35.1
NetQ70_1: Q70.1(B) R35.2
NetQ71_1: Q71.1(B) R35.3
NetQ72_1: Q72.1(B) R35.4
NetQ73_1: Q73.1(B) R36.1
NetQ74_1: Q74.1(B) R36.2
NetQ75_1: Q75.1(B) R36.3
NetQ76_1: Q76.1(B) R36.4
NetQ77_1: Q77.1(B) R37.1
NetQ78_1: Q78.1(B) R37.2
NetQ79_1: Q79.1(B) R37.3
NetQ80_1: Q80.1(B) R37.4
NetQ81_1: Q81.1(B) R38.1
NetQ82_1: Q82.1(B) R38.2
NetQ83_1: Q83.1(B) R38.3
NetQ84_1: Q84.1(B) R38.4
NetQ85_1: Q85.1(B) R39.1
NetQ86_1: Q86.1(B) R39.2
NetQ87_1: Q87.1(B) R39.3
NetQ88_1: Q88.1(B) R39.4
NetQN_1: QN.1(B) R7.2
NetQT1_1: QT1.1(G) U1.1(EXT)
NetQT1_3: QT1.3(S) R1.2 U1.8(CS)
NetR2_1: R2.1 R3.2 U1.3(FB)

Not connected (* = marked no-connect by the designer): DS1 1(32kHz) 3(~{INT}/SQW); FR1 6(NC); IC11 9(SOUT); LED8 2(DOUT); N1 2(Cathode_comma)*; N2 2(Cathode_comma)*; N3 2(Cathode_comma)*; N4 2(Cathode_comma)*; N5 2(Cathode_comma)*; N6 2(Cathode_comma)*; N7 2(Cathode_comma)*; N8 2(Cathode_comma)*; Relay1 2 7; T0 1; T1 1; T2 1; T3 1; U2 4(SENSOR_VP) 5(SENSOR_VN) 7(IO35) 8(IO32) 9(IO33) 17(SD2) 18(SD3) 19(CMD) 20(CLK) 21(SD0) 22(SD1) 24(IO2) 29(IO5) 32(NC); U3 4(AHLB)

## Notes on the sheet
- 数据手册上说不需要LC滤波
- 故留出空位备用，未计算数值
- (near SWD1) 串口下载
- 电源部分
- “1”吸合“0”释放
- 1.1 12V电源输入
- 及触摸开关
- (near U2) GPIO36
- (near U2) GPIO39
- 1.2 170V升压电源
- RGB
- 1.3 5V电源
- 1.4 3.3V电源
- (in symbol beep) +
- (in symbol C-CD) +
- (in symbol C-CM) +
- (in symbol Relay) HFD4/3V
- (in symbol 铜柱) 3mm

## Library data of the parts
BT1 = BATTERY
C2 = C-CD: 贴片钽电容; 版权归属: 源创客; BOM名称: 贴片钽电容; 学习资源: www.ooocke.com
C3-C13 C15 C17-C34 = C: 无极性贴片电容; 版权归属: 源创客; 材质: X7R; BOM名称: 无极性贴片电容; 学习资源: www.ooocke.com
C14 = C: 无极性贴片电容; 版权归属: 源创客; BOM名称: 无极性贴片电容; 学习资源: www.ooocke.com
CON1 = P-DC: 低压电源接口; BOM名称: DC电源接口; 版权归属: 源创客; 学习资源: www.ooocke.com
D1 = Diode 1N4007: 1 Amp General Purpose Rectifier; Published: 8-Jun-2000; LatestRevisionDate: 17-Jul-2002; LatestRevisionNote: Re-released for DXP Platform.; DatasheetVersion: 1998; PackageVersion: Aug-1999; PackageReference: DO-41; Publisher: Altium Limited; PackageDescription: Diode, Axial; Body 5.2 x 2.7 mm (LxDia. max), Lead Dia. 0.86 mm (max); Code_JEDEC: DO-204-AL; ComponentLink1Description: Manufacturer Link; ComponentLink1URL: http://www.fairchildsemi.com/; ComponentLink2Description: Datasheet; ComponentLink2URL: http://www.fairchildsemi.com/ds/1N%2F1N4001.pdf
DETECT = UGN3503: 线性霍尔传感器; 版权归属: 源创客; BOM名称: 线性霍尔传感器; 学习资源: www.ooocke.com
E1 = C-CM: 贴片电解电容; 版权归属: 源创客; BOM名称: 贴片电解电容; 学习资源: www.ooocke.com
EN IO0 S1 = SW-PB: Switch; Published: 24-Mar-1999; LatestRevisionDate: 17-Jul-2002; LatestRevisionNote: Re-released for DXP Platform.; PackageReference: SPST-2; Publisher: Altium Limited
F1 = FU: 贴片保险丝; 版权归属: 源创客; BOM名称: 贴片保险丝; 学习资源: www.ooocke.com
FR1 = FR9833
IC1-IC11 = 74HC595: 8位移位寄存器; 版权归属: 源创客; BOM名称: 8位移位寄存器; 学习资源: www.ooocke.com
J1 = Micro SD: Micro SD卡; 版权归属: 源创客; BOM名称: Micro SD卡; 学习资源: www.ooocke.com
L1 L2 = L-CDRH: 功率屏蔽电感; 版权归属: 源创客; BOM名称: 功率屏蔽电感; 学习资源: www.ooocke.com
L3 L4 = L: 小功率贴片电感; 版权归属: 源创客; BOM名称: 小功率贴片电感; 学习资源: www.ooocke.com
LED_V5 LED_V12 = LED-SMD: 贴片LED; 版权归属: 源创客; BOM名称: 贴片LED; 学习资源: www.ooocke.com
Q1-Q88 = 8050-SMD: 高频放大-NPN型; 版权归属: 源创客; 属性: 40V 1.5A 1W 100MHZ; BOM名称: 高频放大-NPN型; 学习资源: www.ooocke.com
QN = NPN: NPN Bipolar Transistor; Published: 8-Jun-2000; LatestRevisionDate: 17-Jul-2002; LatestRevisionNote: Re-released for DXP Platform.; PackageReference: TO-226; Publisher: Altium Limited; Code_JEDEC: TO-226-AA
QT1 = IRF3710: N沟场效应管; 版权归属: 源创客; BOM名称: N沟场效应管; 学习资源: www.ooocke.com
R0-R6 R8 R9 R12 R14 R15 Rled1 Rled2 = R: 贴片电阻; 版权归属: 源创客; BOM名称: 贴片电阻; 学习资源: www.ooocke.com
R7 R10 R11 = Res Semi: Semiconductor Resistor; Published: 8-Jun-2000; LatestRevisionDate: 17-Jul-2002; LatestRevisionNote: Re-released for DXP Platform.; PackageReference: AXIAL-0.5; Publisher: Altium Limited
R13 R16-R39 = R-8P4R: 贴片网络排阻; 版权归属: 源创客; BOM名称: 贴片网络排阻; 学习资源: www.ooocke.com
Relay1 = Relay
SWD1 = Header 4: Header, 4-Pin; LatestRevisionDate: 17-Jul-2002; LatestRevisionNote: Re-released for DXP Platform.; Publisher: Altium Limited
TP1 = DEBUG: 调试断点焊盘; 版权归属: 源创客; BOM名称: 调试断点焊盘; 学习资源: www.ooocke.com
U2 = ESP32-WROOM-32D: IC: SoC; GPIO, I2C, I2S, IR, SD, SDIO, SPI, UART; 2.7Ã·3.6VDC; 20dBm; MF: Espressif Systems; Package: Module Espressif Systems; Price: None; Availability: Unavailable; MP: ESP32-WROOM-32D; SnapEDA_Link: https://www.snapeda.com/parts/ESP32-WROOM-32D/Espressif%20Systems/view-part/?ref=snap; Value: *
U4 = HT71xx: LDO线性稳压芯片; 版权归属: 源创客; BOM名称: LDO线性稳压芯片; 学习资源: www.ooocke.com
V4 = AMS1117: 三端稳压芯片; BOM名称: 稳压芯片; 版权归属: 源创客; 学习资源: www.ooocke.com
VD1 = SS14: 肖特基二极管; 版权归属: 源创客; 属性: 40V/1A; BOM名称: 肖特基二极管; 学习资源: www.ooocke.com